# Altium schematic sheet 01_MAIN.SchDoc
size B; SheetNumber: 1; SheetTotal: 1
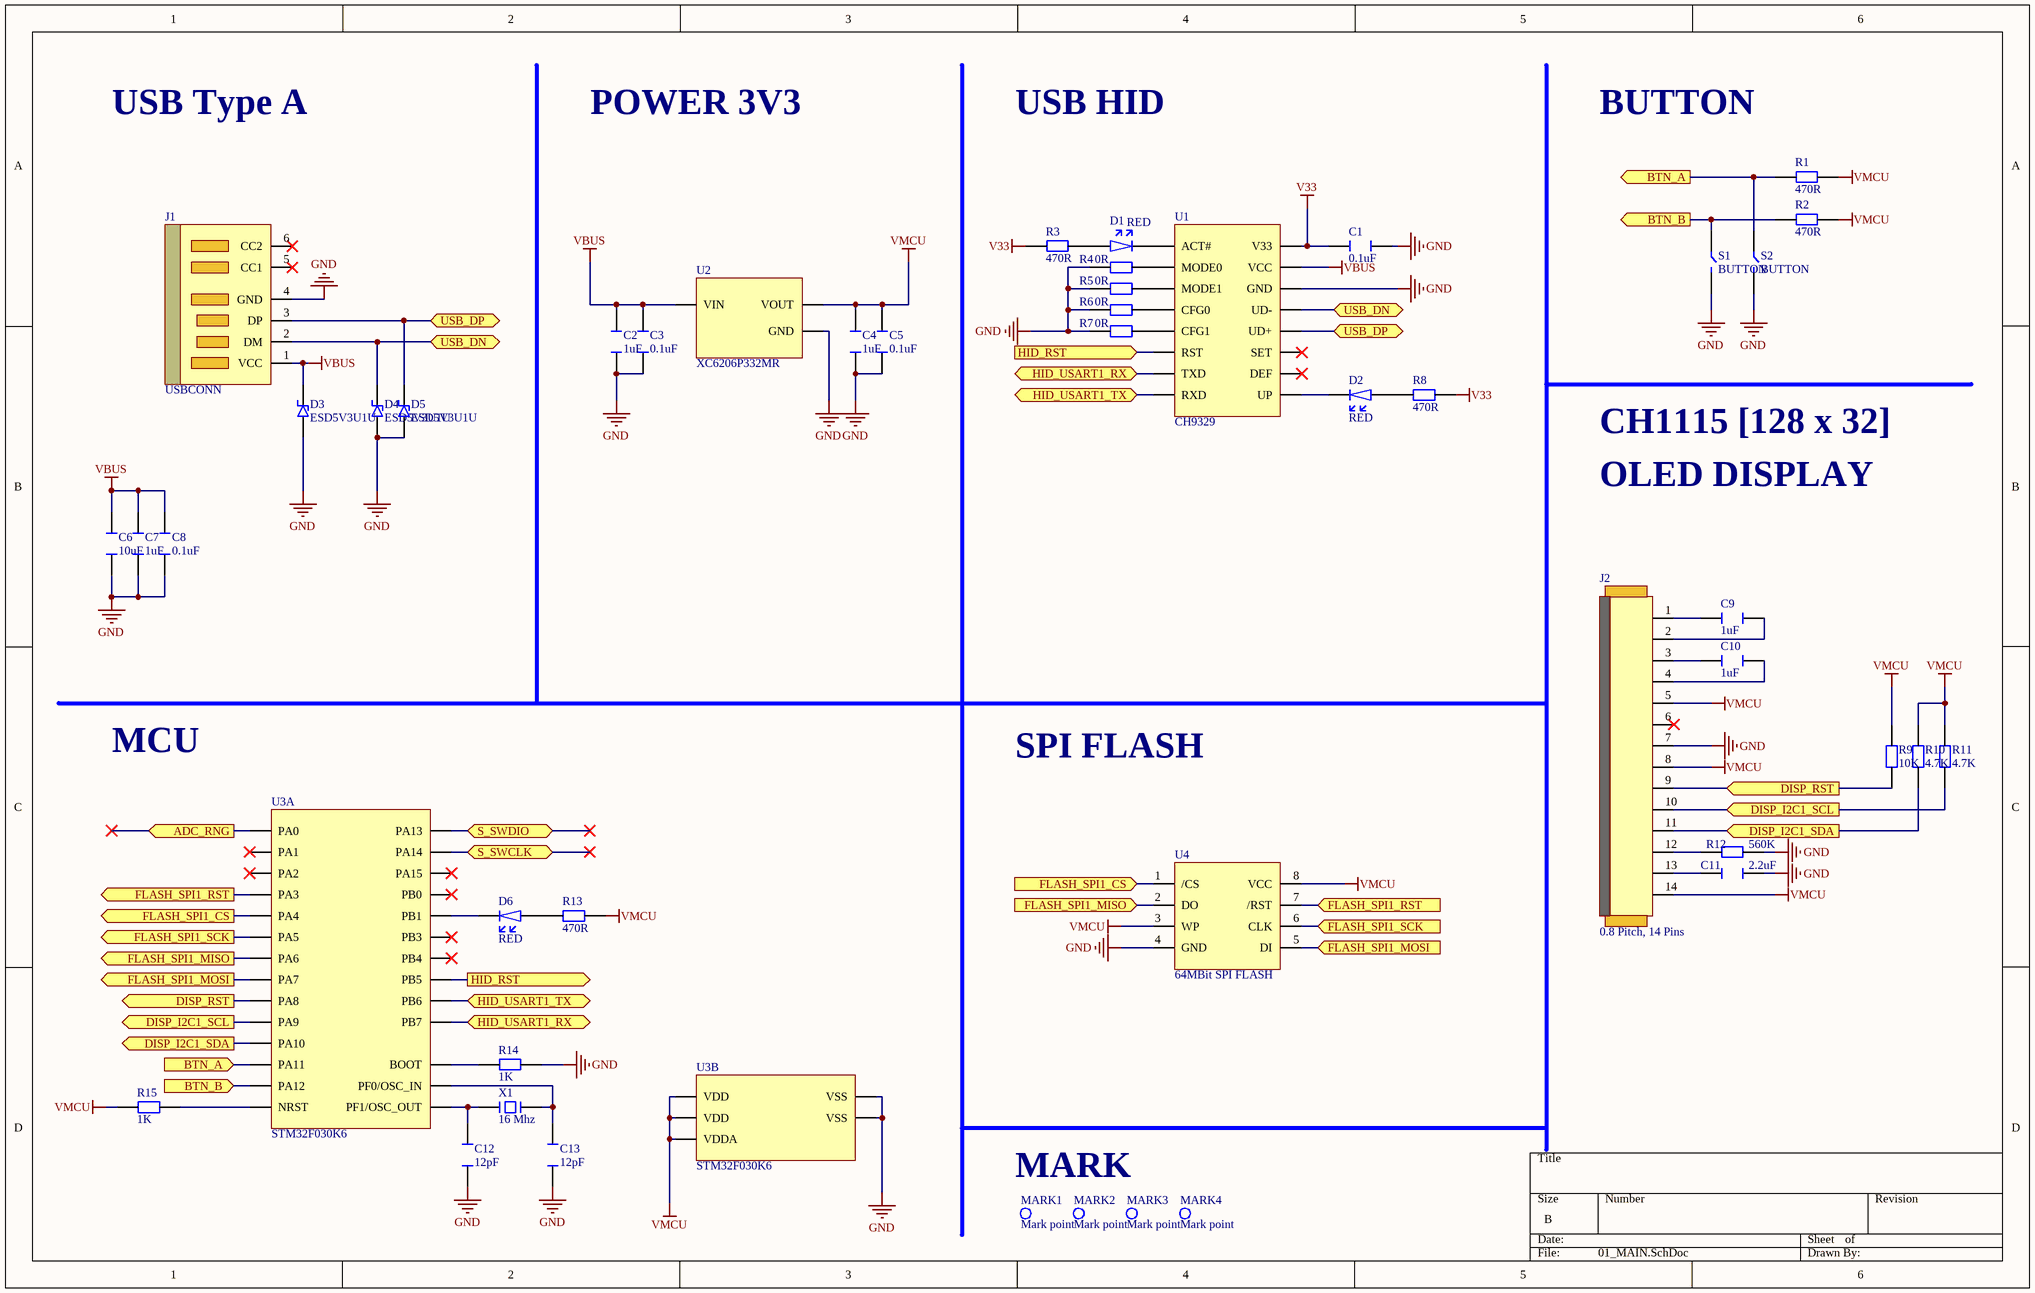
[diagram p0: 01_MAIN.SchDoc]

## Parts
C1  0.1uF  [C0402]
C2  1uF  [C0603]
C3  0.1uF  [C0603]
C4  1uF  [C0402]
C5  0.1uF  [C0402]
C6  10uF  [C0603]
C7  1uF  [C0603]
C8  0.1uF  [C0603]
C9  1uF  [C0402]
C10  1uF  [C0402]
C11  2.2uF  [C0402]
C12  12pF  [C0402]
C13  12pF  [C0402]
D1  RED  [LED0402]
D2  RED  [LED0402]
D3  ESD5V3U1U  [ESD5V3U1U]
D4  ESD5V3U1U  [ESD5V3U1U]
D5  ESD5V3U1U  [ESD5V3U1U]
D6  RED  [LED0402]
J1  USBCONN  [USBAM_SNGLE_8PIN]
J2  0.8 Pitch, 14 Pins  [FPC-14PIN]
MARK1  Mark point  [MARKPOINT]
MARK2  Mark point  [MARKPOINT]
MARK3  Mark point  [MARKPOINT]
MARK4  Mark point  [MARKPOINT]
R1  470R  [R0402]
R2  470R  [R0402]
R3  470R  [R0402]
R4  0R  [R0402]
R5  0R  [R0402]
R6  0R  [R0402]
R7  0R  [R0402]
R8  470R  [R0402]
R9  10K  [R0402]
R10  4.7K  [R0402]
R11  4.7K  [R0402]
R12  560K  [R0402]
R13  470R  [R0402]
R14  1K  [R0402]
R15  1K  [R0402]
S1  BUTTON  [YD3410]
S2  BUTTON  [YD3410]
U1  CH9329  [CH9329]
U2  XC6206P332MR  [XC6206P332MR]
U3  STM32F030K6  [STM32F030K6]  (parts A,B of 2)
U4  64MBit SPI FLASH  [W25Q64JVSSIQ]
X1  16 Mhz  [CSTCE16M0V53-R0]

## Ports
ADC_RNG (in), BTN_A (in), BTN_A (out), BTN_B (in), BTN_B (out), DISP_I2C1_SCL (in), DISP_I2C1_SCL (out), DISP_I2C1_SDA (in), DISP_I2C1_SDA (out), DISP_RST (in), DISP_RST (out), FLASH_SPI1_CS (in), FLASH_SPI1_CS (out), FLASH_SPI1_MISO (in), FLASH_SPI1_MISO (out), FLASH_SPI1_MOSI (in), FLASH_SPI1_MOSI (out), FLASH_SPI1_RST (in), FLASH_SPI1_RST (out), FLASH_SPI1_SCK (in), FLASH_SPI1_SCK (out), HID_RST (in), HID_RST (out), HID_USART1_RX (bidir), HID_USART1_TX (bidir), S_SWCLK (bidir), S_SWDIO (bidir), USB_DN (bidir), USB_DP (bidir)

## Nets
GND: C1.2 C2.1 C3.1 C4.1 C5.1 C6.1 C7.1 C8.1 C11.2 C12.1 C13.1 D3.1 D4.1 D5.1 J1.4(GND) J2.7 R4.1 R5.1 R6.1 R7.1 R12.2 R14.2 S1.2 S2.2 U1.14(GND) U2.1(GND) U3.16(VSS) U3.32(VSS) U4.4(GND)
V33: C1.1 R3.1 R8.2 U1.16(V33)
VBUS: C2.2 C3.2 C6.2 C7.2 C8.2 D3.2 J1.1(VCC) U1.15(VCC) U2.3(VIN)
VMCU: C4.2 C5.2 J2.5 J2.8 J2.14 R1.2 R2.2 R9.2 R10.2 R11.2 R13.2 R15.1 U2.2(VOUT) U3.1(VDD) U3.5(VDDA) U3.17(VDD) U4.3(WP) U4.8(VCC)
ADC_RNG: U3.6(PA0) ; port ADC_RNG
BTN_A: R1.1 S2.1 U3.21(PA11) ; port BTN_A
BTN_B: R2.1 S1.1 U3.22(PA12) ; port BTN_B
DISP_I2C1_SCL: J2.10 R11.1 U3.19(PA9) ; port DISP_I2C1_SCL
DISP_I2C1_SDA: J2.11 R10.1 U3.20(PA10) ; port DISP_I2C1_SDA
DISP_RST: J2.9 R9.1 U3.18(PA8) ; port DISP_RST
FLASH_SPI1_CS: U3.10(PA4) U4.1(/CS) ; port FLASH_SPI1_CS
FLASH_SPI1_MISO: U3.12(PA6) U4.2(DO) ; port FLASH_SPI1_MISO
FLASH_SPI1_MOSI: U3.13(PA7) U4.5(DI) ; port FLASH_SPI1_MOSI
FLASH_SPI1_RST: U3.9(PA3) U4.7(/RST) ; port FLASH_SPI1_RST
FLASH_SPI1_SCK: U3.11(PA5) U4.6(CLK) ; port FLASH_SPI1_SCK
HID_RST: U1.6(RST) U3.28(PB5) ; port HID_RST
HID_USART1_RX: U1.7(TXD) U3.30(PB7) ; port HID_USART1_RX
HID_USART1_TX: U1.8(RXD) U3.29(PB6) ; port HID_USART1_TX
S_SWCLK: U3.24(PA14) ; port S_SWCLK
S_SWDIO: U3.23(PA13) ; port S_SWDIO
USB_DN: D4.2 J1.2(DM) U1.13(UD-) ; port USB_DN
USB_DP: D5.2 J1.3(DP) U1.12(UD+) ; port USB_DP
NetC9_1: C9.1 J2.1
NetC9_2: C9.2 J2.2
NetC10_1: C10.1 J2.3
NetC10_2: C10.2 J2.4
NetC11_1: C11.1 J2.13
NetC12_2: C12.2 U3.3(PF1/OSC_OUT) X1.1
NetC13_2: C13.2 U3.2(PF0/OSC_IN) X1.2
NetD1_1: D1.1 R3.2
NetD1_2: D1.2 U1.1(ACT#)
NetD2_1: D2.1 R8.1
NetD2_2: D2.2 U1.9(UP)
NetD6_1: D6.1 R13.1
NetD6_2: D6.2 U3.15(PB1)
NetJ2_12: J2.12 R12.1
NetR4_2: R4.2 U1.2(MODE0)
NetR5_2: R5.2 U1.3(MODE1)
NetR6_2: R6.2 U1.4(CFG0)
NetR7_2: R7.2 U1.5(CFG1)
NetR14_1: R14.1 U3.31(BOOT)
NetR15_2: R15.2 U3.4(NRST)

Not connected (* = marked no-connect by the designer): J1 5(CC1)* 6(CC2)*; J2 6*; U1 10(DEF)* 11(SET)*; U3 7(PA1)* 8(PA2)* 14(PB0)* 25(PA15)* 26(PB3)* 27(PB4)*

## Notes on the sheet
- USB Type A
- POWER 3V3
- USB HID
- BUTTON
- CH1115 [128 x 32]
- OLED DISPLAY
- MCU
- SPI FLASH
- MARK

## Library data of the parts
C1 C3 C5 C8 = C_0.1UF
C2 C4 C7 C9 C10 = C_1UF
C6 = C_10UF
C11 = C_2.2UF
C12 C13 = C_12PF
D1 D2 D6 = LED_RED
J2 = FPC_14PIN
MARK1-MARK4 = MP
R1-R3 R8 R13 = R_470R
R4-R7 = R_0R
R9 = R_10K
R10 R11 = R_4.7K
R12 = R_560K
R14 R15 = R_1K
U4 = W25Q64JVSSIQ
X1 = CRYSTAL_16MHZ